# EAGLE design SpeechAnalyserV3 (EAGLE 9.6.1)
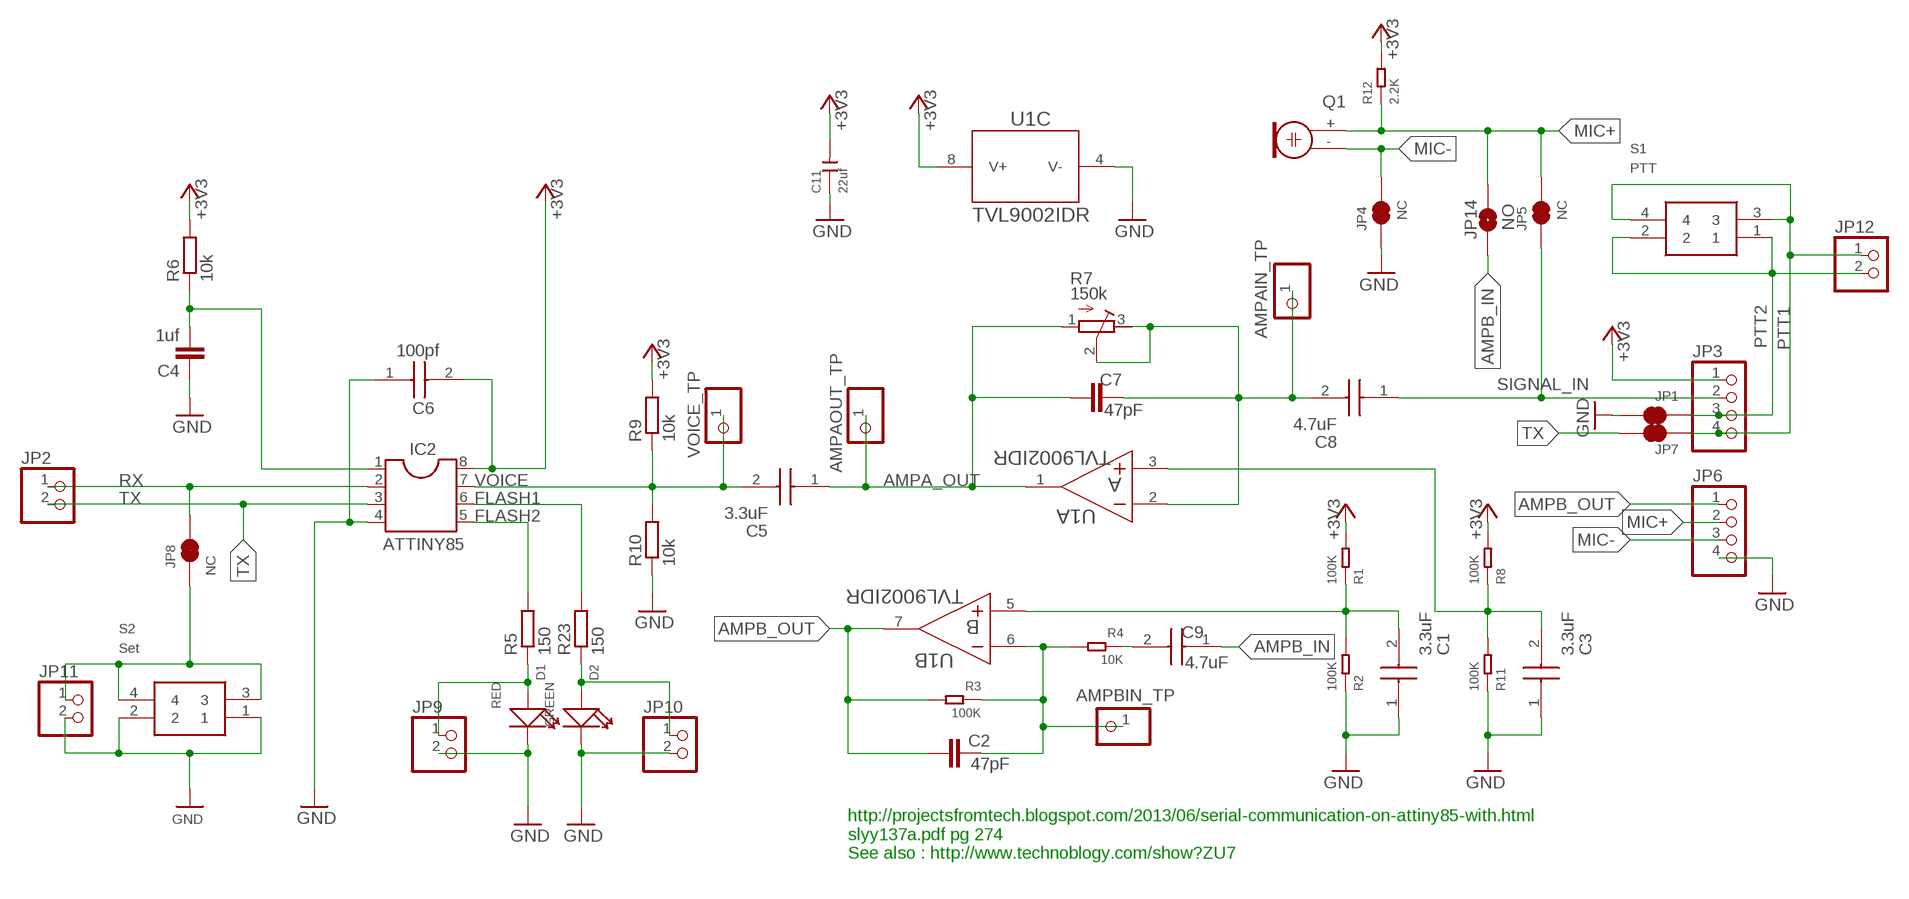
[diagram p0: schematic, sheet 1]

## Parts
AMPA_IN  AMPAIN_TP  PINHD-1X1  [1X01]
AMPA_OUT  AMPAOUT_TP  PINHD-1X1  [1X01]
AMPB_IN  AMPBIN_TP  PINHD-1X1  [1X01]
C1  3.3uF  C0805C105K3RACTU  [CAPC2013X140N]
C2  47pF  C-EUC0805  [C0805]
C3  3.3uF  C0805C105K3RACTU  [CAPC2013X140N]
C4  1uf  C-EUC0805  [C0805]
C5  3.3uF  C0805C105K3RACTU  [CAPC2013X140N]
C6  100pf  885012207080  [CAPC2012X90N]
C7  47pF  C-EUC0805  [C0805]
C8  4.7uF  C0805C105K3RACTU  [CAPC2013X140N]
C9  4.7uF  C0805C105K3RACTU  [CAPC2013X140N]
C11  22uf  CERAMIC-22UF-16V-10%-X7R(1206)  [C1206]
D1  RED  SMD-LED-CLEAR-RED(0805)  [LED-0805]
D2  GREEN  SMD-LED-CLEAR-GREEN(0805)  [LED-0805]
IC2  ATTINY85  DIL8S  [SOCKET-08]
JP1  NC  JUMPER-SMT_2_NC_TRACE_SILK  [SMT-JUMPER_2_NC_TRACE_SILK]
JP2  PINHD-1X2  [1X02]
JP3  PINHD-1X4  [1X04]
JP4  NC  JUMPER-SMT_2_NC_TRACE_SILK  [SMT-JUMPER_2_NC_TRACE_SILK]
JP5  NC  JUMPER-SMT_2_NC_TRACE_SILK  [SMT-JUMPER_2_NC_TRACE_SILK]
JP6  PINHD-1X4  [1X04]
JP7  NC  JUMPER-SMT_2_NC_TRACE_SILK  [SMT-JUMPER_2_NC_TRACE_SILK]
JP8  NC  JUMPER-SMT_2_NC_TRACE_SILK  [SMT-JUMPER_2_NC_TRACE_SILK]
JP9  PINHD-1X2  [1X02]
JP10  PINHD-1X2  [1X02]
JP11  PINHD-1X2  [1X02]
JP12  PINHD-1X2  [1X02]
JP14  NO  JUMPER-SMT_2_NO_SILK  [SMT-JUMPER_2_NO_SILK]
Q1  ELECTRET  [9.7ELECTRET]
R1  100K  SMD-RES-100R-5%-1/8W(0805)  [R0805]
R2  100K  SMD-RES-100R-5%-1/8W(0805)  [R0805]
R3  100K  SMD-RES-100R-5%-1/8W(0805)  [R0805]
R4  10K  SMD-RES-100R-5%-1/8W(0805)  [R0805]
R5  150  R-EU_R0805  [R0805]
R6  10k  R-EU_R0805  [R0805]
R7  150k  R-TRIMM64W  [RTRIM64W]
R8  100K  SMD-RES-100R-5%-1/8W(0805)  [R0805]
R9  10k  R-EU_R0805  [R0805]
R10  10k  R-EU_R0805  [R0805]
R11  100K  SMD-RES-100R-5%-1/8W(0805)  [R0805]
R12  2.2K  SMD-RES-2.2K-5%-1/8W(0805)  [R0805]
R23  150  R-EU_R0805  [R0805]
S1  PTT  B3FS-1000P  [B3FS-1000P]
S2  Set  B3FS-1000P  [B3FS-1000P]
U1  TVL9002IDR  TLV9002IDR  [D0008A_N]
VOICE  VOICE_TP  PINHD-1X1  [1X01]

## Nets
+3V3: C6.2 C11.2 IC2.8 JP3.1 R1.2 R6.2 R8.2 R9.2 R12.2 U1.8(C:V+)
AMPA_OUT: AMPA_OUT.1 C5.1(C1) C7.1 R7.1(A) U1.1(A:OUT)
AMPB_IN: C9.1(C1) JP14.1
AMPB_OUT: C2.1 JP6.1 R3.2 U1.7(B:OUT)
FLASH1: IC2.6 R23.2
FLASH2: IC2.5 R5.2
GND: C1.1(C1) C3.1(C1) C4.1 C6.1 C11.1 D1.- D2.- IC2.4 JP1.1 JP4.1 JP6.4 JP9.2 JP10.2 JP11.2 R2.1 R10.1 R11.1 S2.1 S2.2 U1.4(C:V-)
MIC+: JP5.2 JP6.2 JP14.2 Q1.+ R12.1
MIC-: JP4.2 JP6.3 Q1.-
N$1: C9.2(C2) R4.1
N$2: C3.2(C2) R8.1 R11.2 U1.3(A:IN+)
N$3: C1.2(C2) R1.1 R2.2 U1.5(B:IN+)
N$5: AMPB_IN.1 C2.2 R3.1 R4.2 U1.6(B:IN-)
N$12: D1.+ JP9.1 R5.1
N$14: D2.+ JP10.1 R23.1
N$16: AMPA_IN.1 C7.2 C8.2(C2) R7.2(S) R7.3(E) U1.2(A:IN-)
N$19: C4.2 IC2.1 R6.1
N$20: JP8.1 JP11.1 S2.3 S2.4
PTT1: JP3.4 JP7.2 JP12.1 S1.3 S1.4
PTT2: JP1.2 JP3.3 JP12.2 S1.1 S1.2
RX: IC2.2 JP2.1 JP8.2
SIGNAL_IN: C8.1(C1) JP3.2 JP5.1
TX: IC2.3 JP2.2 JP7.1
VOICE: C5.2(C2) IC2.7 R9.1 R10.2 VOICE.1

## Notes on the sheet
- http://projectsfromtech.blogspot.com/2013/06/serial-communication-on-attiny85-with.html
  slyy137a.pdf pg 274
  See also : http://www.technoblogy.com/show?ZU7

## Library data of the parts
AMPA_IN AMPA_OUT AMPB_IN VOICE = pinhead:PINHD-1X1: PIN HEADER
C1 C3 C5 C8 C9 = SamacSys_Parts:C0805C105K3RACTU: CAPACITOR, 0805 1uF +/-10% 25V Source: Datasheet <https://componentsearchengine.com/Datasheets/1/C0805C105K3RACTU.pdf>; HEIGHT: mm; MANUFACTURER_NAME: Kemet
C2 C4 C7 = rcl:C-EU: CAPACITOR, European symbol; SPICEPREFIX: C
C6 = SamacSys_Parts:885012207080: Multilayer Ceramic Capacitors MLCC - SMD/SMT WCAP-CSGP 100pF 0805 10% 50V MLCC Source: Datasheet <https://mouser.componentsearchengine.com/Datasheets/1/885012207080.pdf>; DESCRIPTION: Multilayer Ceramic Capacitors MLCC - SMD/SMT WCAP-CSGP 100pF 0805 10% 50V MLCC; DISPLAY_VALUE: 100pf; HEIGHT: 0.9mm; MANUFACTURER_NAME: Wurth Elektronik; MANUFACTURER_PART_NUMBER: 885012207080
C11 = OPL_Capacitor:CERAMIC-22UF-16V-10%-X7R(1206): 302010182
D1 = OPL_Optoelectronics:SMD-LED-CLEAR-RED(0805): 304090046; MPN: 17-215SURC/S530-A2/TR8; VALUE: RED-0805
D2 = OPL_Optoelectronics:SMD-LED-CLEAR-GREEN(0805): 304090057; MPN: 17-215SYGC/S530-E2/TR8; VALUE: GREEN-0805
IC2 = ic-package:DIL8: Dual In Line / Socket
JP1 JP4 JP5 JP7 JP8 = SparkFun-Jumpers:JUMPER-SMT_2_NC_TRACE: Normally closed trace jumper This jumper has a trace between two pads so it's normally closed (NC). Use a razor knife to open the connection. For best results follow the IPC guidelines for cutting traces: Cutout at least 0.063 mm (0.005 in). Remove all loose material to clean up the cut area. Seal the cut with an approved epoxy. Reapply solder to reclose the connection.
JP2 JP9-JP12 = pinhead:PINHD-1X2: PIN HEADER
JP3 JP6 = pinhead:PINHD-1X4: PIN HEADER
JP14 = SparkFun-Jumpers:JUMPER-SMT_2_NO: Normally open jumper This jumper has two pads in close proximity to each other. Apply solder to close the connection. Round pads are easier to solder for beginners, but are a lot larger. SparkFun Product that uses the round pads: SparkFun EL Sequencer <https://www.sparkfun.com/products/12781>
Q1 = adafruit:ELECTRET: Electret microphone Thru hole 2.54mm spacing with 9.7mm diameter
R1-R4 R8 R11 = OPL_Resistor:SMD-RES-100R-5%-1/8W(0805): 301010319; MPN: RC0805JR-07100RL; VALUE: 100R
R5 R6 R9 R10 R23 = resistor:R-EU_: RESISTOR, European symbol
R7 = resistor:R-TRIMM: Trimm resistor
R12 = OPL_Resistor:SMD-RES-2.2K-5%-1/8W(0805): 301012193; MPN: RC0805JR-072K2L
S1 S2 = SamacSys_Parts:B3FS-1000P: Switch Tact,6x6mm,flat act,gen purp,tape Plunger Tactile Switch, SPST-NO 0.05 A@ 24 V dc 0.5mm Source: Datasheet <https://componentsearchengine.com/Datasheets/1/B3FS-1000P.pdf>; DESCRIPTION: Switch Tact,6x6mm,flat act,gen purp,tape Plunger Tactile Switch, SPST-NO 0.05 A@ 24 V dc 0.5mm; HEIGHT: mm; MANUFACTURER_NAME: Omron Electronics; MANUFACTURER_PART_NUMBER: B3FS-1000P; MOUSER_PART_NUMBER: 653-B3FS-1000P; MOUSER_PRICE-STOCK: https://www.mouser.com/Search/Refine.aspx?Keyword=653-B3FS-1000P
U1 = TLV9002IDR:TLV9002IDR; MANUFACTURER: Texas Instruments; PARTNUMBER: TLV9002IDR; REFDES: RefDes; TYPE: TYPE; VALUE: Value

## Board
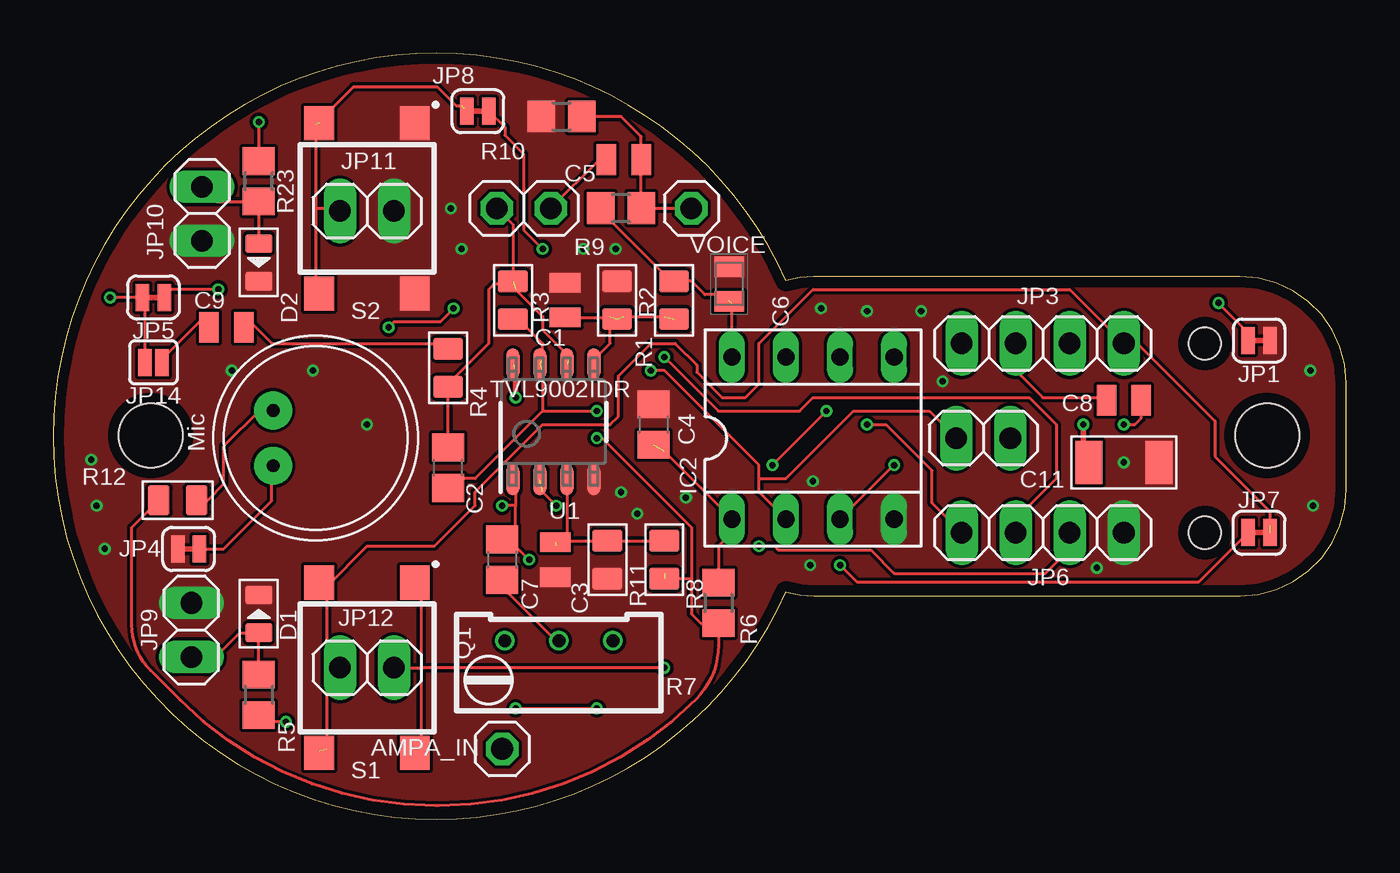
[diagram p1: board, top side]
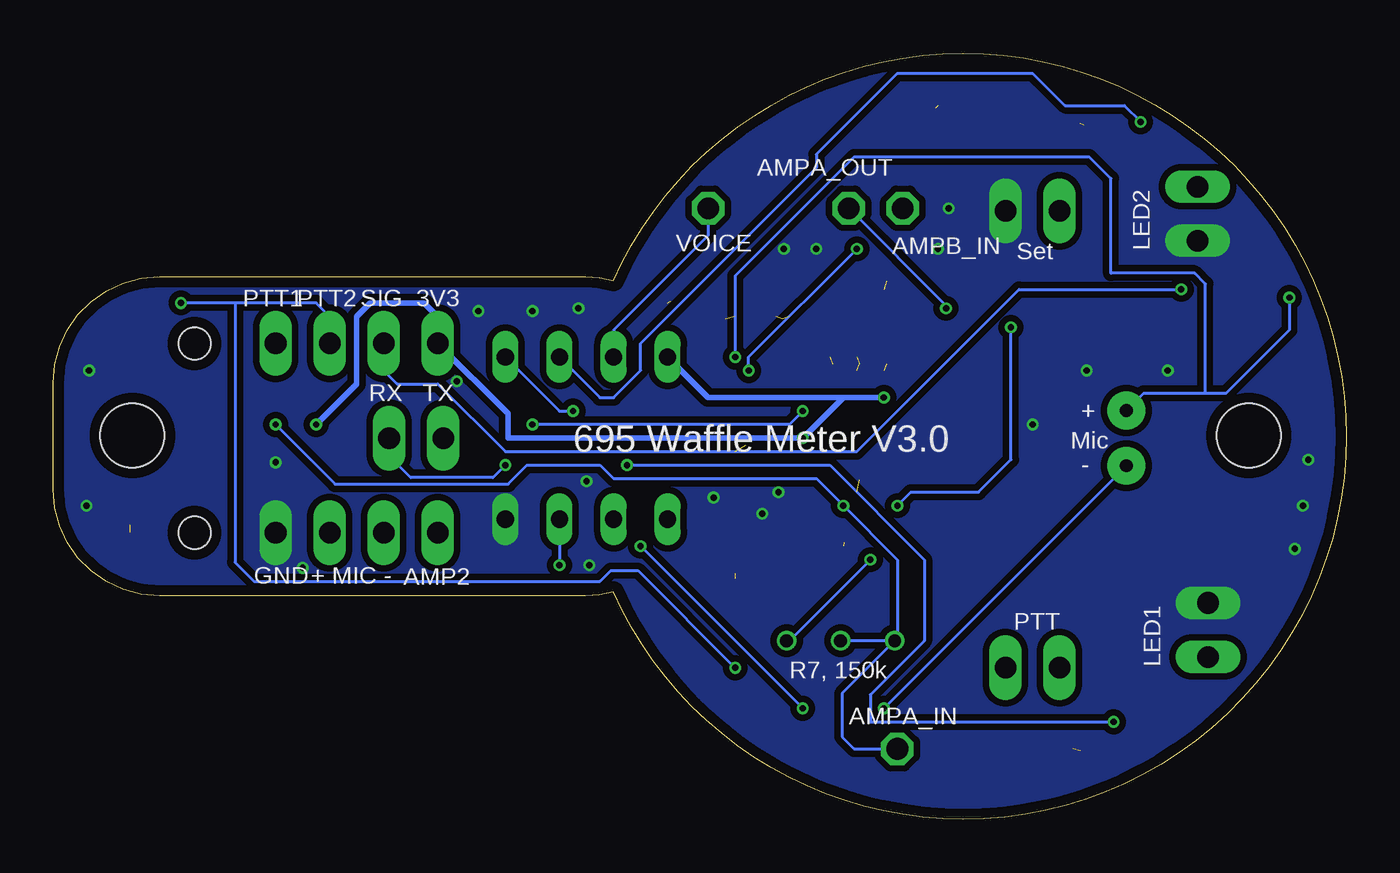
[diagram p2: board, bottom side, seen from below]

Size 60.75 x 36 mm. Coordinates in mm from the lower left corner, seen from the top.
Outline: 0,18 0.03,17.03 0.1,16.06 0.23,15.1 0.41,14.15 0.65,13.21 0.93,12.28 1.26,11.36 1.65,10.47 2.08,9.6 2.55,8.75 3.08,7.93 3.64,7.14 4.25,6.38 4.9,5.65 5.59,4.96 6.31,4.31 7.07,3.7 7.86,3.12 8.69,2.6 9.53,2.11 10.41,1.67 11.31,1.28 12.23,0.95 13.16,0.66 14.11,0.42 15.07,0.24 16.04,0.1 17.02,0.03 18,0 18.95,0.03 19.89,0.1 20.82,0.22 21.75,0.4 22.67,0.62 23.58,0.89 24.46,1.21 25.34,1.57 26.19,1.98 27.01,2.43 27.82,2.92 28.59,3.46 29.34,4.03 30.05,4.64 30.73,5.29 31.38,5.97 31.99,6.69 32.56,7.44 33.09,8.21 33.58,9.01 34.03,9.84 34.43,10.68 35.08,10.55 35.75,10.5 55.75,10.5 56.62,10.57 57.47,10.8 58.26,11.17 58.98,11.68 59.59,12.29 60.09,13.01 60.45,13.8 60.68,14.64 60.75,15.5 60.75,20.5 60.68,21.36 60.45,22.2 60.09,22.99 59.59,23.71 58.98,24.33 58.26,24.83 57.47,25.2 56.62,25.43 55.75,25.5 35.75,25.5 35.08,25.45 34.42,25.32 34.02,26.16 33.57,26.99 33.08,27.79 32.55,28.56 31.98,29.31 31.37,30.02 30.73,30.7 30.05,31.35 29.33,31.97 28.59,32.54 27.81,33.08 27.01,33.57 26.18,34.02 25.33,34.43 24.46,34.79 23.57,35.11 22.67,35.38 21.75,35.6 20.82,35.77 19.89,35.9 18.94,35.97 18,36 17.06,35.98 16.12,35.9 15.18,35.78 14.25,35.61 13.33,35.38 12.43,35.12 11.54,34.8 10.67,34.44 9.82,34.03 8.99,33.58 8.19,33.09 7.41,32.56 6.67,31.99 5.95,31.38 5.27,30.73 4.62,30.04 4.01,29.32 3.43,28.57 2.9,27.8 2.41,26.99 1.96,26.16 1.55,25.31 1.19,24.44 0.88,23.55 0.61,22.65 0.39,21.74 0.22,20.81 0.1,19.88 0.02,18.94 0,18
Outline: 0,18 0,18
Copper layers (1*2*15*16): Top 0.035559375mm / dielectric 0.47751875mm / Route2 0.035559375mm / dielectric 0.47751875mm / Route15 0.035559375mm / dielectric 0.47751875mm / Bottom 0.035559375mm
Design rules "default JGE Seeed MicroBearSpecial 6mm Trace .5 edge *": minimum track width 6mil, minimum drill 0.3mm, track to track 6mil, track to pad 6mil, pad to pad 6mil, via to via 6mil, smd to smd 6mil, copper to edge 0.5mm, drill to drill 4mil, minimum pad ring 5mil, minimum via ring 5mil, stop-mask expansion 4mil, vias tented up to drill 25mil, thermal gap 0mil
Holes 3 mm at 4.58,18.04 57.03,18.04
Holes 1.5 mm at 54.11,13.47 54.11,22.36

### Footprints (pad centres in the part's own frame; a part is rotated, then mirrored left to right if it is on the bottom)
1X01 = drill 1.016 octagon: 1 0,0
CAPC2013X140N = smd 0.914 x 1.448: 1 -0.813,0; 2 0.813,0
C0805 = smd 1.3 x 1.5: 1 -0.95,0; 2 0.95,0
CAPC2012X90N = smd 0.96 x 1.39: 1 -0.81,0; 2 0.81,0
C1206 = smd 1.27 x 2.032: 1 -1.651,0; 2 1.651,0
LED-0805 = smd 0.889 x 1.27: + -0.889,0; - 0.889,0
SOCKET-08 = drill 0.813 long: 1 -3.81,-3.81; 2 -1.27,-3.81; 3 1.27,-3.81; 4 3.81,-3.81; 5 3.81,3.81; 6 1.27,3.81; 7 -1.27,3.81; 8 -3.81,3.81
SMT-JUMPER_2_NC_TRACE_SILK = smd 0.635 x 1.27: 1 -0.508,0; 2 0.508,0
1X02 = drill 1.016 long: 1 -1.27,0; 2 1.27,0
1X04 = drill 1.016 long: 1 -3.81,0; 2 -1.27,0; 3 1.27,0; 4 3.81,0
SMT-JUMPER_2_NO_SILK = smd 0.635 x 1.27: 1 -0.406,0; 2 0.406,0
9.7ELECTRET = drill 0.6 pad 1.778: + 1.3,2; - -1.3,2
R0805 = smd 1.397 x 1.016: 1 0,0.889; 2 0,-0.889
R0805' = smd 1.3 x 1.5: 1 -0.95,0; 2 0.95,0
RTRIM64W = drill 0.61: 1 1.27,-2.54; 2 1.27,0; 3 1.27,2.54
B3FS-1000P = smd 1.6 x 1.4: 1 4,-2.25; 2 -4,-2.25; 3 4,2.25; 4 -4,2.25
D0008A_N = smd 1.45 x 0.6: 1 -2.725,1.905; 2 -2.725,0.635; 3 -2.725,-0.635; 4 -2.725,-1.905; 5 2.725,-1.905; 6 2.725,-0.635; 7 2.725,0.635; 8 2.725,1.905

### Placement (x,y rotation side)
AMPA_IN  21.09,3.31 0 top
AMPA_OUT  23.38,28.71 0 top
AMPB_IN  20.84,28.71 0 top
C1  24.04,24.39 270 top
C2  18.55,16.52 90 top
C3  23.59,12.2 90 top
C4  28.2,18.55 270 top
C5  26.81,31 0 top
C6  31.76,25.15 270 top
C7  21.09,12.2 270 top
C8  50.3,19.69 0 top
C9  8.14,23.12 0 top
C11  50.3,16.77 180 top
D1  9.66,9.66 90 top
D2  9.66,26.17 270 top
IC2  35.7,17.91 0 top
JP1  56.65,22.49 180 top
JP2  43.7,17.91 0 top
JP3  46.49,22.36 0 top
JP4  6.36,12.71 0 top
JP5  4.71,24.52 180 top
JP6  46.49,13.47 0 top
JP7  56.65,13.47 0 top
JP8  19.95,33.28 0 top
JP9  6.49,8.9 90 top
JP10  6.99,28.46 270 top
JP11  14.74,28.58 0 top
JP12  14.74,7.12 0 top
JP14  4.71,21.47 180 top
Q1  12.33,17.91 90 top
R1  29.16,24.39 180 top
R2  26.49,24.39 0 top
R3  21.6,24.39 0 top
R4  18.55,21.22 0 top
R5  150  [R0805']  9.66,5.85 270 top
R6  10k  [R0805']  31.25,10.17 270 top
R7  23.76,7.12 90 top
R8  28.71,12.2 0 top
R9  10k  [R0805']  26.68,28.71 180 top
R10  10k  [R0805']  23.88,33.03 0 top
R11  26.04,12.2 180 top
R12  5.85,14.99 270 top
R23  150  [R0805']  9.66,29.98 90 top
S1  14.74,7.12 90 top
S2  14.74,28.71 90 top
U1  23.5,18.68 90 top
VOICE  29.98,28.71 0 top

### Tracks (layer width: path | path; a pad name or v marks a point on that pad's centre or on a via)
+3V3  (via drill 0.3)  (3 unrouted)
  Top 0.152: 48.4,17.28 C11.2 | IC2.8 31.89,24.27 | 29.35,11.56 28.71,11.56 | 29.98,11.31 29.98,13.72 25.79,17.91 v25.54,17.91 | C6.2 31.46,24.65 30.62,24.65 29.98,25.28 R1.2 29.03,25.28 25.73,28.58 R9.2 | 29.98,11.31 29.98,9.66 30.42,9.22 R6.2 31.25,8.17 arc-45 30.2,5.64 arc-45 18.13,0.64 17.96,0.64 arc-45 5.96,5.61 4.58,7 arc-45 3.69,9.13 3.69,13.72 R12.2 | R8.2 29.98,11.31
  Top 0.254: v48.4,18.55 48.4,17.28 | v21.73,19.82 21.73,21.09
  Bottom 0.254: v48.4,18.55 46.49,20.45 46.49,23.63 45.86,24.27 43.32,24.27 42.68,23.63 JP3.1 39.38,19.06 39.38,17.91 v25.54,17.91 23.63,19.82 | 23.63,19.82 29.98,19.82 IC2.8 | 23.63,19.82 v21.73,19.82
AMPA_OUT  (via drill 0.3)
  Top 0.152: 21.73,14.74 21.73,13.47 21.09,12.84 C7.1 21.09,13.47 v22.36,12.2 | 21.73,14.74 v21.09,14.74 | U1.1 21.73,15.82 21.73,14.74 | v15.76,23.12 16.01,23.38 18.17,23.38 v18.8,24.01 | AMPA_OUT.1 25.66,31 C5.1
  Bottom 0.152: v22.36,12.2 26.17,8.39 R7.1 | v18.8,24.01 18.8,24.14 AMPA_OUT.1 | v21.09,14.74 20.46,15.38 17.28,15.38 15.76,16.9 v15.76,23.12
AMPB_IN
  Top 0.152: JP14.1 5.22,21.73 7.12,23.63 C9.1
AMPB_OUT  (via drill 0.3)  (2 unrouted)
  Top 0.152: 23,21.73 23,22.36 21.73,23.63 R3.2 | 23,19.18 19.82,16.01 18.55,16.01 C2.1 | 23,21.09 23,19.18 | v38.24,18.55 39.12,18.55 41.28,16.39 41.28,14.87 JP6.1 | 23,19.18 v25.54,19.18
  Bottom 0.152: v38.24,18.55 26.17,18.55 v25.54,19.18
FLASH1  (via drill 0.3)
  Top 0.152: v9.66,32.77 R23.2
  Bottom 0.152: IC2.6 35.06,19.82 34.43,19.82 33.16,21.09 33.16,22.36 24.9,30.61 24.9,31.25 21.09,35.06 14.74,35.06 13.22,33.54 10.42,33.54 v9.66,32.77
FLASH2  (via drill 0.3)
  Top 0.152: v10.93,4.58 9.66,4.58 R5.2 | v36.33,19.18 v33.79,16.64
  Bottom 0.152: v10.93,4.58 22.36,4.58 22.36,5.85 19.82,8.39 19.82,12.2 24.27,16.64 v33.79,16.64 | v36.33,19.18 36.97,19.18 IC2.5
GND  (via drill 0.3)
  other vias: 2.04,14.74 2.42,12.71 1.79,16.9 12.2,21.09 14.74,18.55 18.68,28.71 41.79,20.58 50.3,16.77 38.24,23.88 40.78,23.88 36.08,24.01 59.06,21.09 59.19,14.74 27.44,14.36 26.68,15.38 24.9,26.8 26.42,26.8 19.19,26.8 35.57,11.95 35.7,15.88 49.03,11.82 8.39,21.09 29.73,15.12
  pour Top: 0,18 0,18 0.03,17.03 0.1,16.06 0.23,15.1 0.41,14.15 0.65,13.21 0.93,12.28 1.26,11.36 1.65,10.47 2.08,9.6 2.55,8.75 3.08,7.93 3.64,7.14 4.25,6.38 4.9,5.65 5.59,4.96 6.31,4.31 7.07,3.7 7.86,3.12 8.68,2.59 9.53,2.11 10.41,1.67 11.31,1.29 12.23,0.95 13.16,0.66 14.11,0.42 15.07,0.24 16.04,0.11 17.02,0.03 18,0 18.94,0.03 19.89,0.1 20.82,0.22 21.75,0.4 22.67,0.62 23.58,0.89 24.46,1.21 25.34,1.57 26.19,1.98 27.01,2.43 27.82,2.92 28.59,3.46 29.34,4.03 30.05,4.64 30.73,5.29 31.38,5.97 31.99,6.69 32.56,7.44 33.09,8.21 33.58,9.01 34.03,9.83 34.43,10.68 35.08,10.55 35.75,10.5 55.75,10.5 56.62,10.58 57.47,10.8 58.26,11.17 58.98,11.67 59.59,12.29 60.09,13.01 60.45,13.8 60.68,14.64 60.75,15.5 60.75,20.5 60.68,21.36 60.45,22.2 60.09,22.99 59.59,23.71 58.98,24.33 58.26,24.83 57.47,25.2 56.62,25.42 55.75,25.5 35.75,25.5 35.08,25.45 34.42,25.32 34.02,26.16 33.57,26.99 33.08,27.79 32.55,28.56 31.98,29.31 31.37,30.02 30.73,30.71 30.05,31.35 29.33,31.97 28.59,32.54 27.81,33.08 27.01,33.57 26.18,34.02 25.33,34.43 24.46,34.79 23.57,35.11 22.67,35.38 21.75,35.6 20.82,35.77 19.89,35.9 18.94,35.97 18,36 17.06,35.98 16.12,35.9 15.18,35.78 14.25,35.61 13.33,35.39 12.43,35.12 11.54,34.8 10.67,34.44 9.82,34.03 8.99,33.58 8.19,33.09 7.41,32.56 6.67,31.99 5.95,31.38 5.27,30.73 4.62,30.04 4.01,29.32 3.43,28.57 2.9,27.8 2.41,26.99 1.96,26.16 1.55,25.31 1.19,24.44 0.88,23.55 0.61,22.65 0.39,21.74 0.22,20.81 0.1,19.88 0.02,18.94
  pour Top (isolate 0.305): 0,18 0,18 0.03,17.03 0.1,16.06 0.23,15.1 0.41,14.15 0.65,13.21 0.93,12.28 1.26,11.36 1.65,10.47 2.08,9.6 2.55,8.75 3.08,7.93 3.64,7.14 4.25,6.38 4.9,5.65 5.59,4.96 6.31,4.31 7.07,3.7 7.86,3.12 8.68,2.59 9.53,2.11 10.41,1.67 11.31,1.29 12.23,0.95 13.16,0.66 14.11,0.42 15.07,0.24 16.04,0.11 17.02,0.03 18,0 18.94,0.03 19.89,0.1 20.82,0.22 21.75,0.4 22.67,0.62 23.58,0.89 24.46,1.21 25.34,1.57 26.19,1.98 27.01,2.43 27.82,2.92 28.59,3.46 29.34,4.03 30.05,4.64 30.73,5.29 31.38,5.97 31.99,6.69 32.56,7.44 33.09,8.21 33.58,9.01 34.03,9.83 34.43,10.68 35.08,10.55 35.75,10.5 55.75,10.5 56.62,10.58 57.47,10.8 58.26,11.17 58.98,11.67 59.59,12.29 60.09,13.01 60.45,13.8 60.68,14.64 60.75,15.5 60.75,20.5 60.68,21.36 60.45,22.2 60.09,22.99 59.59,23.71 58.98,24.33 58.26,24.83 57.47,25.2 56.62,25.42 55.75,25.5 35.75,25.5 35.08,25.45 34.42,25.32 34.02,26.16 33.57,26.99 33.08,27.79 32.55,28.56 31.98,29.31 31.37,30.02 30.73,30.71 30.05,31.35 29.33,31.97 28.59,32.54 27.81,33.08 27.01,33.57 26.18,34.02 25.33,34.43 24.46,34.79 23.57,35.11 22.67,35.38 21.75,35.6 20.82,35.77 19.89,35.9 18.94,35.97 18,36 17.06,35.98 16.12,35.9 15.18,35.78 14.25,35.61 13.33,35.39 12.43,35.12 11.54,34.8 10.67,34.44 9.82,34.03 8.99,33.58 8.19,33.09 7.41,32.56 6.67,31.99 5.95,31.38 5.27,30.73 4.62,30.04 4.01,29.32 3.43,28.57 2.9,27.8 2.41,26.99 1.96,26.16 1.55,25.31 1.19,24.44 0.88,23.55 0.61,22.65 0.39,21.74 0.22,20.81 0.1,19.88 0.02,18.94
  pour Bottom (isolate 0.305): 0.03,17.03 0,18 0,18 0.02,18.94 0.1,19.88 0.22,20.81 0.39,21.74 0.61,22.65 0.88,23.55 1.19,24.44 1.55,25.31 1.96,26.16 2.41,26.99 2.9,27.8 3.43,28.57 4.01,29.32 4.62,30.04 5.27,30.73 5.95,31.38 6.67,31.99 7.41,32.56 8.19,33.09 8.99,33.58 9.82,34.03 10.67,34.44 11.54,34.8 12.43,35.12 13.33,35.39 14.25,35.61 15.18,35.78 16.12,35.9 17.06,35.98 18,36 18.94,35.97 19.89,35.9 20.82,35.77 21.75,35.6 22.67,35.38 23.57,35.11 24.46,34.79 25.33,34.43 26.18,34.02 27.01,33.57 27.81,33.08 28.59,32.54 29.33,31.97 30.05,31.35 30.73,30.71 31.37,30.02 31.98,29.31 32.55,28.56 33.08,27.79 33.57,26.99 34.02,26.16 34.42,25.32 35.08,25.45 35.75,25.5 55.75,25.5 56.62,25.42 57.47,25.2 58.26,24.83 58.98,24.33 59.59,23.71 60.09,22.99 60.45,22.2 60.68,21.36 60.75,20.5 60.75,15.5 60.68,14.64 60.45,13.8 60.09,13.01 59.59,12.29 58.98,11.67 58.26,11.17 57.47,10.8 56.62,10.58 55.75,10.5 35.75,10.5 35.08,10.55 34.43,10.68 34.03,9.83 33.58,9.01 33.09,8.21 32.56,7.44 31.99,6.69 31.38,5.97 30.73,5.29 30.05,4.64 29.34,4.03 28.59,3.46 27.82,2.92 27.01,2.43 26.19,1.98 25.34,1.57 24.46,1.21 23.58,0.89 22.67,0.62 21.75,0.4 20.82,0.22 19.89,0.1 18.94,0.03 18,0 17.02,0.03 16.04,0.11 15.07,0.24 14.11,0.42 13.16,0.66 12.23,0.95 11.31,1.29 10.41,1.67 9.53,2.11 8.68,2.59 7.86,3.12 7.07,3.7 6.31,4.31 5.59,4.96 4.9,5.65 4.25,6.38 3.64,7.14 3.08,7.93 2.55,8.75 2.08,9.6 1.65,10.47 1.26,11.36 0.93,12.28 0.65,13.21 0.41,14.15 0.23,15.1 0.1,16.06
MIC+  (via drill 0.3)
  Top 0.152: v28.71,21.73 31.25,19.18 35.06,19.18 35.7,19.82 45.86,19.82 47.13,18.55 47.13,16.01 45.22,14.11 JP6.2 | JP14.2 4.3,24.42 JP5.2 v2.68,24.52 | R12.1 7.25,14.99 8.01,15.76 8.01,17.53 9.69,19.21 Q1.+
  Bottom 0.152: v28.71,21.73 28.71,25.54 23.12,31.12 12.07,31.12 11.06,30.11 11.06,25.66 7.12,25.66 6.61,25.15 6.61,20.07 6.68,20.01 | v2.68,24.52 2.68,23 5.66,20.01 6.68,20.01 | 6.68,20.01 9.53,20.01 Q1.+
MIC-  (via drill 0.3)
  Top 0.152: v21.73,5.21 v25.54,5.21 | Q1.- 10.26,16.55 10.26,14.96 8.01,12.71 JP4.2 | v33.16,12.84 33.9,12.84 34.08,12.66 38.41,12.66 39.51,11.56 46.62,11.56 47.76,12.71 JP6.3
  Bottom 0.152: v25.54,5.21 v33.16,12.84 | v21.73,5.21 10.93,16.01 Q1.-
N$1
  Top 0.152: R4.1 18.55,22.36 10.3,22.36 9.03,23.63 C9.2
N$2  (1 unrouted)
  Top 0.152: U1.3 24.14,13.34 23.63,12.84 | C3.2 23.67,13.09 R11.2 R8.1
N$3  (3 unrouted)
  Top 0.152: 26.81,23.63 28.71,23.63 | U1.5 25.41,21.6 26.17,22.36 26.17,23.63 | C1.2 26.41,23.58 R2.2
N$5  (2 unrouted)
  Top 0.152: C2.2 R4.2 18.55,20.45 20.46,22.36 20.46,24.9 20.71,25.15 21.47,25.15 R3.1 21.6,27.95 AMPB_IN.1 | 24.27,21.73 23,23 23,23.63 21.73,24.9
N$12
  Top 0.152: R5.1 D1.+ 8.77,8.77 7.63,7.63 JP9.1
N$14
  Top 0.152: D2.+ R23.1 7.69,29.03 JP10.1
N$16  (via drill 0.3)  (1 unrouted)
  Top 0.152: C7.2 21.09,10.93 23.63,8.39 R7.2 | v23.63,14.74 23,15.38 | v50.3,18.55 50.81,18.55 51.11,18.86 C8.2
  Bottom 0.152: v50.3,18.55 47.51,15.76 39.38,15.76 38.49,16.64 35.06,16.64 34.43,16.01 24.9,16.01 v23.63,14.74 21.09,12.2 21.09,8.52 R7.3 | R7.3 23.69,5.91 23.69,3.88 23.12,3.31 AMPA_IN.1 | 21.54,8.07 R7.3 | R7.3 R7.2
N$19  (1 unrouted)
  Top 0.152: R6.1 31.25,12.84 31.89,13.47 IC2.1 28.71,17.28
N$20  (3 unrouted)
  Top 0.152: 12.51,32.7 12.33,32.52 12.33,28.71 | 12.33,32.65 14.11,34.42 18.04,34.42 18.93,33.53 19.19,33.53 | 12.33,28.71 12.33,24.87 S2.4 | 12.33,28.71 13.34,28.71 JP11.1 | JP8.1 19.31,33.41
PTT1  (2 unrouted)
  Top 0.152: 12.84,10.93 12.84,7.25 | 12.84,7.25 12.84,3.31 | 12.84,10.93 14.74,12.84 17.92,12.84 19.82,14.74 19.82,15.38 23,18.55 26.17,18.55 26.55,18.93 26.55,20.84 28.08,22.36 29.22,22.36 30.23,21.34 30.23,21.01 31.43,19.82 32.52,19.82 33.16,20.45 33.16,22.36 35.7,24.9 47.76,24.9 JP3.4 50.94,22.36 54.57,18.72 54.57,17.05 57.16,14.47 57.16,13.83 | 12.84,10.93 S1.3 | 12.49,3.22 S1.4 | JP12.1 12.96,7.12 12.84,7.25
PTT2  (via drill 0.3)
  Top 0.152: 17.28,7.12 17.28,10.93 S1.1 | 17.28,7.12 17.28,3.31 S1.2 | v54.75,24.27 56.02,23 JP1.2 | v28.71,7.12 17.28,7.12 | JP12.2 17.28,7.12
  Bottom 0.152: 52.21,24.27 48.4,24.27 47.76,23.63 JP3.3 | 52.21,24.27 v54.75,24.27 | 52.21,24.27 52.21,12.07 51.32,11.18 35.06,11.18 34.55,11.69 33.28,11.69 v28.71,7.12
RX  (via drill 0.3)
  Top 0.152: v23,26.8 22.11,27.69 22.11,31.25 21.22,32.14 21.22,32.52 JP8.2 | v28.08,21.09 28.71,21.09 33.16,16.64 33.16,16.01 | 33.16,16.01 33.16,15.38 IC2.2 | 33.16,16.01 34.43,16.01 37.6,19.18 41.16,19.18 JP2.1
  Bottom 0.152: v23,26.8 28.08,21.73 v28.08,21.09
SIGNAL_IN  (via drill 0.3)
  Top 0.152: v7.76,24.9 5.22,24.9 JP5.1 | JP3.2 45.22,21.09 46.49,19.82 49.67,19.82 C8.1
  Bottom 0.152: v7.76,24.9 15.38,24.9 23,17.28 39.51,17.28 42.68,20.45 44.59,20.45 45.22,21.09 JP3.2
TX  (via drill 0.3)
  Top 0.152: v39.51,16.64 IC2.3 | v36.97,11.95 37.78,11.13 53.81,11.13 JP7.1
  Bottom 0.152: IC2.3 v36.97,11.95 | v39.51,16.64 40.09,16.06 43.95,16.06 44.97,17.08 JP2.2
VOICE
  Top 0.152: VOICE.1 R9.1 27.62,28.72 C5.2 27.62,32.09 26.68,33.03 R10.2
  Bottom 0.152: IC2.7 34.43,23 29.98,27.44 VOICE.1

### Text on the board
tNames: Mic
bNames: AMPA_OUT | LED2 | Set | AMPB_IN | VOICE | 3V3 | SIG | PTT2 | PTT1 | TX | RX | + | Mic | 695 Waffle Meter V3.0 | - | AMP2 | + MIC - | GND | LED1 | PTT | R7, 150k | AMPA_IN
tValues: 1 | 4 | 1 | 2 | + | - | 1 | 4